# Altium schematic sheet USB_DEBUG.SchDoc
size A4; SheetNumber: 7; SheetTotal: 7
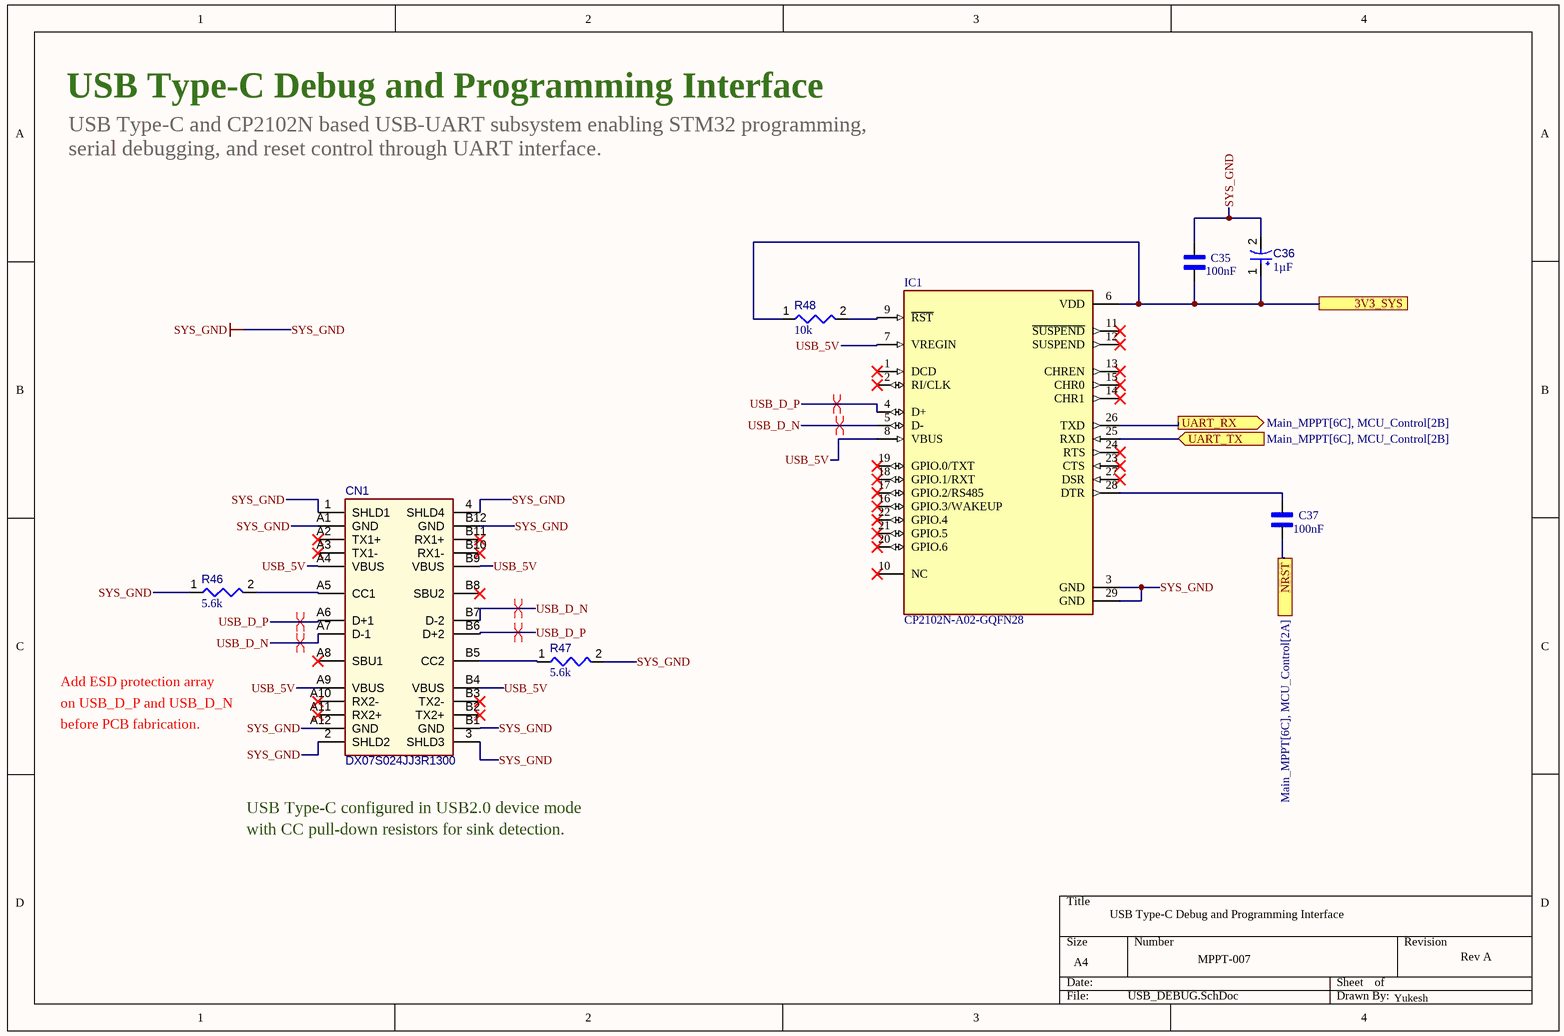
[diagram p0: USB_DEBUG.SchDoc]

## Parts
C35  value 100nF  [CAPC1608X90N]  (hidden comment: 0603YC104KAZ2A)
C36  value 1µF  [CAPMP3217X18-T_V]  (hidden comment: TAJA105K035RNJ)
C37  value 100nF  [CAPC1608X90N]  (hidden comment: 0603YC104KAZ2A)
CN1  DX07S024JJ3R1300  [JAE-DX07S024JJ3_V]
IC1  CP2102N-A02-GQFN28  [QFN50P500X500X80-29N]
R46  value 5.6k  [RESC0402(1005)_L]  (hidden comment: 5D6KR2J)
R47  value 5.6k  [RESC0402(1005)_L]  (hidden comment: 5D6KR2J)
R48  value 10k  [RESC0402(1005)_L]  (hidden comment: 10KR2F)

## Ports
3V3_SYS (see Main_MPPT[6B], BMS_CORE[2C], MCU_Control[2A], OUTPUT_CONNECTORS[4B], POWER_DISTRIBUTION[4C], POWER_SWITCH[2C], POWER_SWITCH[2D]), NRST (see Main_MPPT[6C], MCU_Control[2A]), UART_RX (out, see Main_MPPT[6C], MCU_Control[2B]), UART_TX (in, see Main_MPPT[6C], MCU_Control[2B])

## Nets
SYS_GND: C35.2 C36.2 CN1.1(SHLD1) CN1.2(SHLD2) CN1.3(SHLD3) CN1.4(SHLD4) CN1.A1(GND) CN1.A12(GND) CN1.B1(GND) CN1.B12(GND) IC1.3(GND) IC1.29(GND) R46.1 R47.2
3V3_SYS: C35.1 C36.1 IC1.6(VDD) R48.1 ; port 3V3_SYS
NRST: C37.1 ; port NRST
UART_RX: IC1.26(TXD) ; port UART_RX
UART_TX: IC1.25(RXD) ; port UART_TX
USB_5V: CN1.A4(VBUS) CN1.A9(VBUS) CN1.B4(VBUS) CN1.B9(VBUS) IC1.7(VREGIN) IC1.8(VBUS)
USB_D_N: CN1.A7(D-1) CN1.B7(D-2) IC1.5(D-)
USB_D_P: CN1.A6(D+1) CN1.B6(D+2) IC1.4(D+)
NetC37_2: C37.2 IC1.28(DTR)
NetCN1_A5: CN1.A5(CC1) R46.2
NetCN1_B5: CN1.B5(CC2) R47.1
NetIC1_9: IC1.9(~{RST}) R48.2

Not connected (* = marked no-connect by the designer): CN1 A2(TX1+)* A3(TX1-)* A8(SBU1)* A10(RX2-)* A11(RX2+)* B2(TX2+)* B3(TX2-)* B8(SBU2)* B10(RX1-)* B11(RX1+)*; IC1 1(DCD)* 2(RI/CLK)* 10(NC)* 11(~{SUSPEND})* 12(SUSPEND)* 13(CHREN)* 14(CHR1)* 15(CHR0)* 16(GPIO.3/WAKEUP)* 17(GPIO.2/RS485)* 18(GPIO.1/RXT)* 19(GPIO.0/TXT)* 20(GPIO.6)* 21(GPIO.5)* 22(GPIO.4)* 23(CTS)* 24(RTS)* 27(DSR)*

## Layout directives
differential pair: USB_D_N, USB_D_P

## Notes on the sheet
- USB Type-C Debug and Programming Interface
- USB Type-C and CP2102N based USB-UART subsystem enabling STM32 programming,
- serial debugging, and reset control through UART interface.
- Add ESD protection array
- on USB_D_P and USB_D_N
- before PCB fabrication.
- USB Type-C configured in USB2.0 device mode
- with CC pull-down resistors for sink detection.
- MPPT-007
- Rev A
- Yukesh

## Library data of the parts
C35 C37 = CMP-001-00089-1: Capacitor MLCC 0603 100nF 16V; MF: AVX; MP: 0603YC104KAZ2A; SnapEDA_Link: https://www.snapeda.com/parts/0603YC104KAZ2A/AVX/view-part/?ref=snap; Case/Package: 1608 AVX; Source: 0603YC104KAZ2A.SchLib; Check_prices: https://www.snapeda.com/parts/0603YC104KAZ2A/AVX/view-part/?ref=eda; Pins: 2; Design Item ID: 0603YC104KAZ2A; Component Type: Standard
C36 = CMP-001-00040-7: Standard Tantalum, 1 uF, +/- 10%, 35 V, -55 to 125 degC, 1206 (3216 Metric), RoHS, Tape and Reel; Manufacturer: AVX; Voltage Rating: 35V; ESR: 7.5Ohm; Package Quantity: 2000; Case/Package: 1206; Datasheet Version: Feb-16; Tolerance: 10%; Max Operating Temperature: 125°C; Mounting Technology: SM; Package URL: http://www.avx.com/download/software/literature/AVX-Footprint-Library.pdf; Package Reference: CAPMP3217X18-T; Manufacturer URL: http://www.avx.com/; Min Operating Temperature: -55°C; Pins: 2; RoHS Compliant: True; Packaging: TapeandReel; Resistance: 7.5Ohm; Package Description: 2-Pin Surface Mount Device, Body 3.2 x 1.65 mm; Datasheet URL: http://datasheets.avx.com/TAJ.pdf; Capacitor Type: Tantalum
CN1 = CMP-002-00065-3: USB-C Connector, 20 V, 1.25 A, -30 to 80 degC, RoHS, Tape and Reel; Gender: Receptacle; Pins: 28; Connector Type: USB-C
IC1 = CMP-062-000000-1: USB TO UART BRIDGE, -40 TO 85DEG C; Bridge Type:USB to UART; Supply Voltage Min:3V; Supply Voltage Max:3.6V; Interface Case Style:QFN; No. of Pins:28Pins; Operating Temperature Min:-40Â°C; Operating Temperature Max:85Â°C; Product Range:-; Automotive Quali; MF: Silicon Labs; MP: CP2102NA02GQFN28; Check_prices: https://www.snapeda.com/parts/CP2102NA02GQFN28/Silicon+Labs/view-part/?ref=eda; Component Type: Standard; Pin Count: 29; SnapEDA_Link: https://www.snapeda.com/parts/CP2102NA02GQFN28/Silicon+Labs/view-part/?ref=snap; Source: CP2102N-A02-GQFN28.SchLib; Design Item ID: CP2102N-A02-GQFN28; Value: *; Package: None
R46 R47 = CMP-009-00108-2: 5K6 0.063W 5% 0402 (1005 Metric)  SMD; Power: 63mW; Tolerance: 5%; Case/Package: 0402; Mounting Technology: SMT; Pins: 2
R48 = CMP-009-00066-2: 10K 0.063W 1% 0402 (1005 Metric)  SMD; Power: 63mW; Case/Package: 0402; Mounting Technology: SMT; Pins: 2; Tolerance: 1%